# EAGLE design Clone (EAGLE 6.5.0)
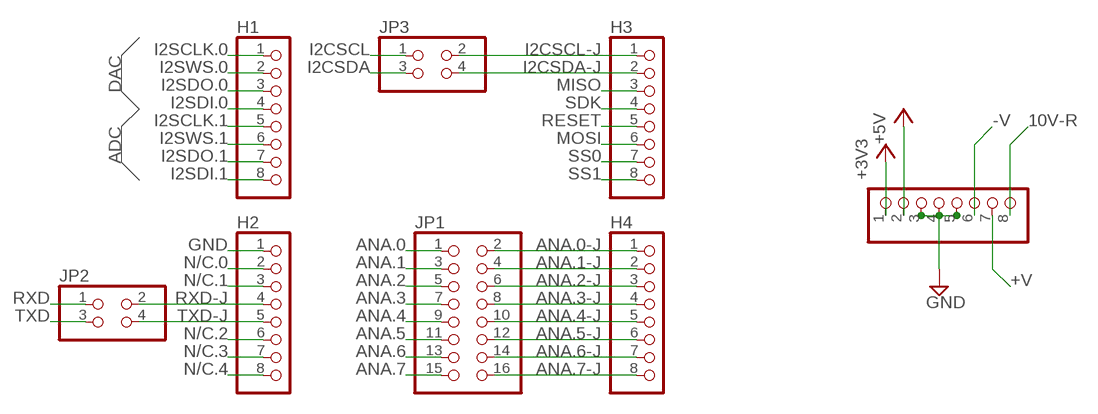
[diagram p0: schematic, sheet 1]

## Parts
H1  PINHD-1X8  [1X08]
H2  PINHD-1X8  [1X08]
H3  PINHD-1X8  [1X08]
H4  PINHD-1X8  [1X08]
H5  PINHD-1X8  [1X08]
JP1  PINHD-2X8  [2X08]
JP2  PINHD-2X2  [2X02]
JP3  PINHD-2X2  [2X02]

## Nets
10V-R: H5.8
+3V3: H5.1
+5V: H5.2
+V: H5.7
-V: H5.6
ANA.0: JP1.1
ANA.0-J: H4.1 JP1.2
ANA.1: JP1.3
ANA.1-J: H4.2 JP1.4
ANA.2: JP1.5
ANA.2-J: H4.3 JP1.6
ANA.3: JP1.7
ANA.3-J: H4.4 JP1.8
ANA.4: JP1.9
ANA.4-J: H4.5 JP1.10
ANA.5: JP1.11
ANA.5-J: H4.6 JP1.12
ANA.6: JP1.13
ANA.6-J: H4.7 JP1.14
ANA.7: JP1.15
ANA.7-J: H4.8 JP1.16
GND: H2.1 H5.3 H5.4 H5.5
I2CSCL: JP3.1
I2CSCL-J: H3.1 JP3.2
I2CSDA: JP3.3
I2CSDA-J: H3.2 JP3.4
I2SCLK.0: H1.1
I2SCLK.1: H1.5
I2SDI.0: H1.4
I2SDI.1: H1.8
I2SDO.0: H1.3
I2SDO.1: H1.7
I2SWS.0: H1.2
I2SWS.1: H1.6
MISO: H3.3
MOSI: H3.6
N/C.0: H2.2
N/C.1: H2.3
N/C.2: H2.6
N/C.3: H2.7
N/C.4: H2.8
RESET: H3.5
RXD: JP2.1
RXD-J: H2.4 JP2.2
SCK: H3.4
SS0: H3.7
SS1: H3.8
TXD: JP2.3
TXD-J: H2.5 JP2.4

## Notes on the sheet
- DAC | I2SCLK.0 | I2CSCL | I2CSCL-J
- I2SWS.0 | I2CSDA | I2CSDA-J
- I2SDO.0 | MISO
- I2SDI.0 | SDK
- ADC | I2SCLK.1 | RESET | -V | 10V-R
- I2SWS.1 | MOSI
- I2SDO.1 | SS0
- I2SDI.1 | SS1
- GND | ANA.0 | ANA.0-J
- N/C.0 | ANA.1 | ANA.1-J
- N/C.1 | ANA.2 | ANA.2-J | +V
- RXD | RXD-J | ANA.3 | ANA.3-J
- TXD | TXD-J | ANA.4 | ANA.4-J
- N/C.2 | ANA.5 | ANA.5-J
- N/C.3 | ANA.6 | ANA.6-J
- N/C.4 | ANA.7 | ANA.7-J

## Library data of the parts
H1-H5 = pinhead:PINHD-1X8: PIN HEADER
JP1 = pinhead:PINHD-2X8: PIN HEADER
JP2 JP3 = pinhead:PINHD-2X2: PIN HEADER

## Board
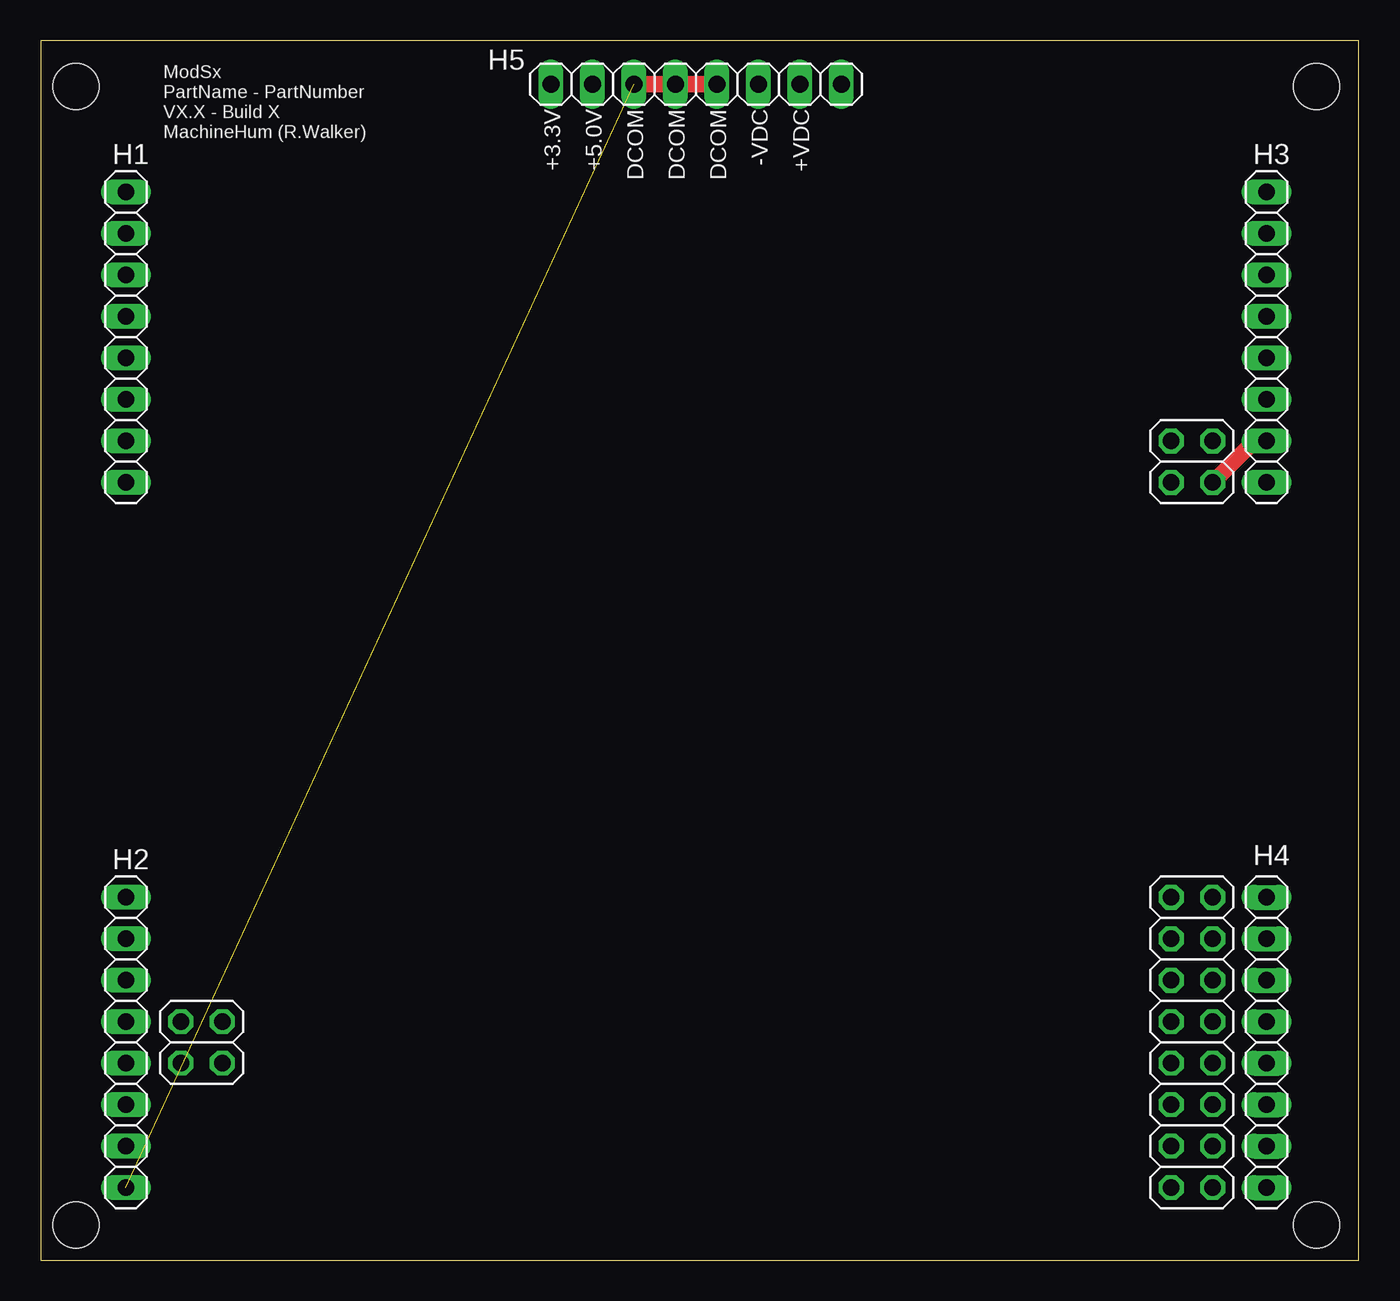
[diagram p1: board, top side]
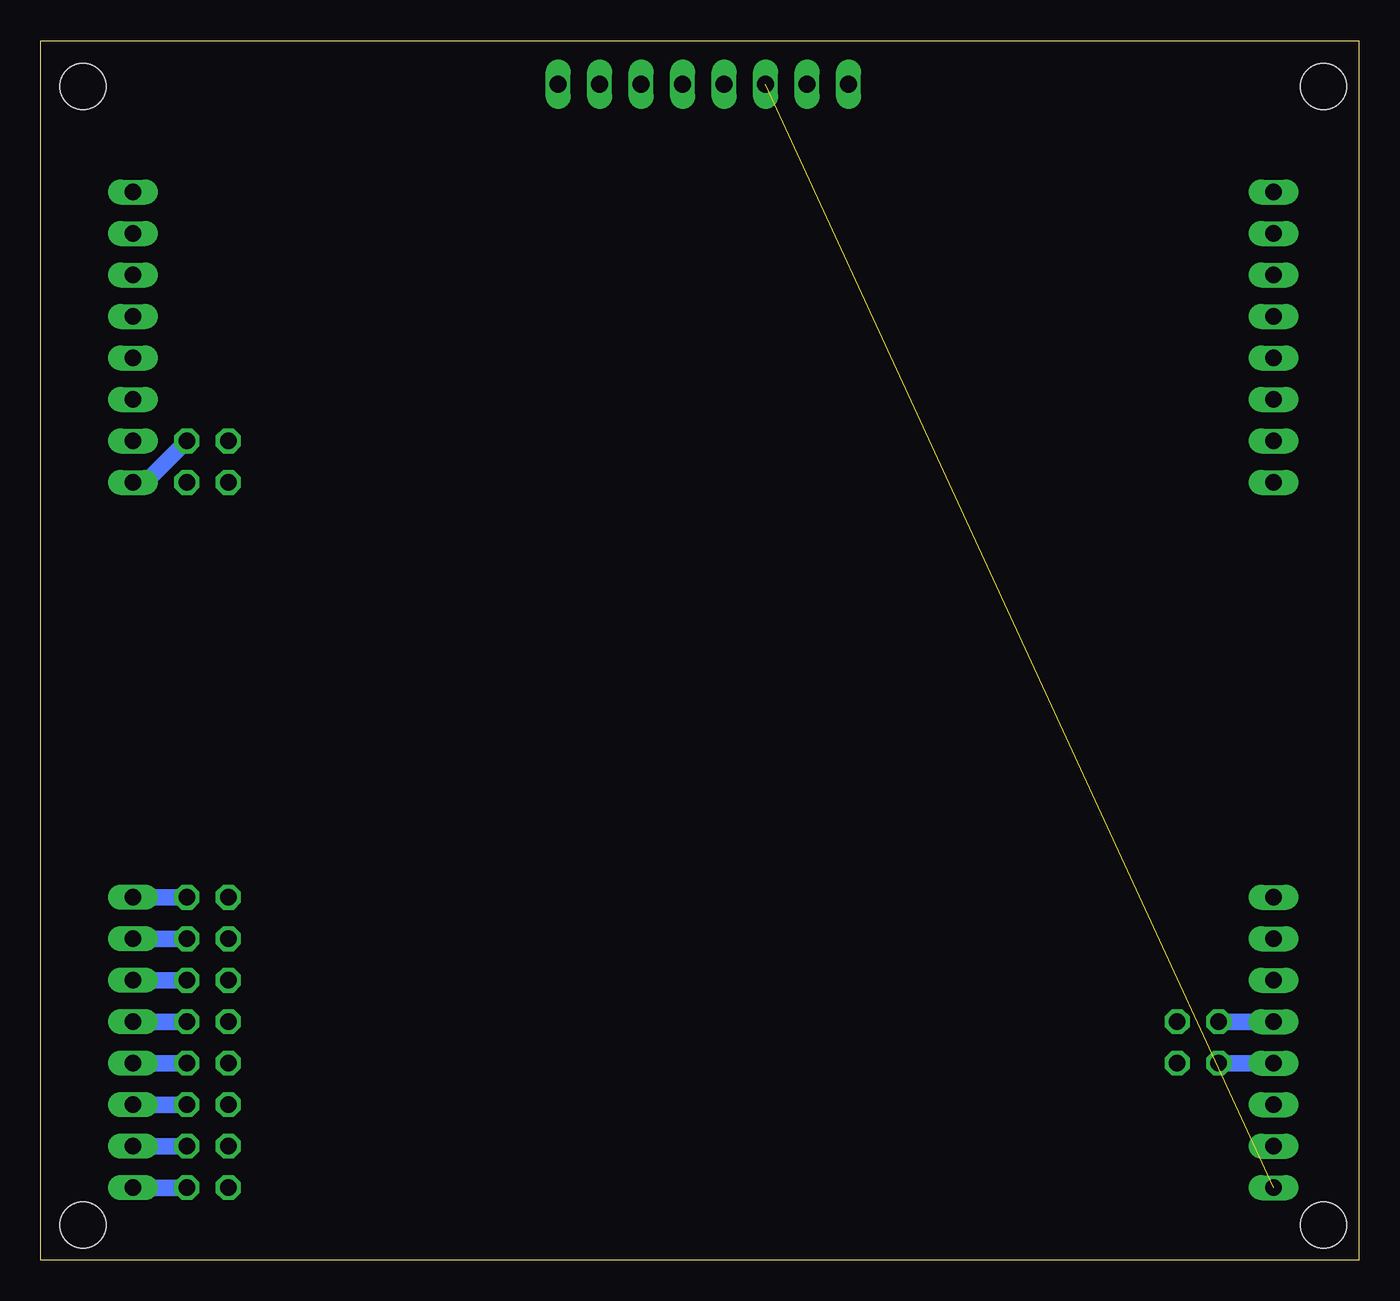
[diagram p2: board, bottom side, seen from below]

Size 80.7 x 74.67 mm. Coordinates in mm from the lower left corner, seen from the top.
Outline: 0,0 80.7,0 80.7,74.67 0,74.67 0,0
Copper layers (1*16): Top 0.035mm / dielectric 1.5mm / Bottom 0.035mm
Design rules "default": minimum track width 10mil, minimum drill 24mil, track to track 8mil, track to pad 8mil, pad to pad 8mil, via to via 8mil, smd to smd 8mil, copper to edge 40mil, drill to drill 8mil, minimum pad ring 10mil, minimum via ring 8mil, stop-mask expansion 4mil, vias tented up to drill 0mil, thermal gap 10mil
Holes 2.8 mm at 2.16,71.88 78.11,71.88 2.16,2.16 78.11,2.16

### Footprints (pad centres in the part's own frame; a part is rotated, then mirrored left to right if it is on the bottom)
1X08 = drill 1.016 long: 1 -8.89,0; 2 -6.35,0; 3 -3.81,0; 4 -1.27,0; 5 1.27,0; 6 3.81,0; 7 6.35,0; 8 8.89,0
2X08 = drill 1.016 octagon: 1 -8.89,-1.27; 2 -8.89,1.27; 3 -6.35,-1.27; 4 -6.35,1.27; 5 -3.81,-1.27; 6 -3.81,1.27; 7 -1.27,-1.27; 8 -1.27,1.27; 9 1.27,-1.27; 10 1.27,1.27; 11 3.81,-1.27; 12 3.81,1.27; 13 6.35,-1.27; 14 6.35,1.27; 15 8.89,-1.27; 16 8.89,1.27
2X02 = drill 1.016 octagon: 1 -1.27,-1.27; 2 -1.27,1.27; 3 1.27,-1.27; 4 1.27,1.27

### Placement (x,y rotation side)
H1  5.21,56.52 90 top
H2  5.21,13.34 90 top
H3  75.06,56.52 90 top
H4  75.06,13.34 270 top
H5  40.13,72.01 0 top
JP1  70.48,13.34 270 top
JP2  9.84,13.34 90 top
JP3  70.48,48.9 270 top

### Tracks (layer width: path | path; a pad name or v marks a point on that pad's centre or on a via)
ANA.0-J
  Bottom 1.016: JP1.2 H4.1
ANA.1-J
  Bottom 1.016: H4.2 JP1.4
ANA.2-J
  Bottom 1.016: JP1.6 H4.3
ANA.3-J
  Bottom 1.016: H4.4 JP1.8
ANA.4-J
  Bottom 1.016: H4.5 JP1.10
ANA.5-J
  Bottom 1.016: H4.6 JP1.12
ANA.6-J
  Bottom 1.016: H4.7 JP1.14
ANA.7-J
  Bottom 1.016: H4.8 JP1.16
GND  (1 unrouted)
  Top 1.016: H5.3 H5.4 H5.5
I2CSCL-J
  Bottom 1.016: H3.1 74.3,47.62 JP3.2
I2CSDA-J
  Top 1.016: H3.2 74.3,50.16 JP3.4
RXD-J
  Bottom 1.016: JP2.2 H2.4
TXD-J
  Bottom 1.016: JP2.4 H2.5

### Text on the board
tPlace: +3.3V | +5.0V | DCOM | DCOM | DCOM | -VDC | +VDC | ModSx / PartName - PartNumber / VX.X - Build X / MachineHum (R.Walker)